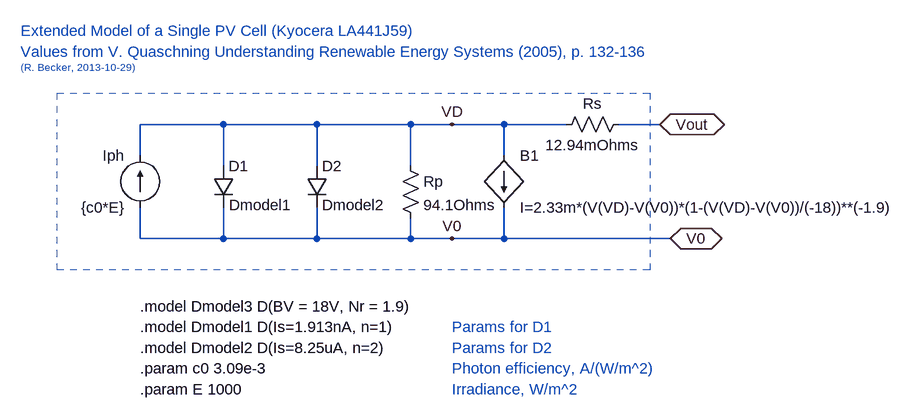
[diagram p0: schematic PVcellExt.asc]
PVcellExt.asc, the LTspice schematic file:
Version 4
SHEET 1 1108 680
WIRE 0 32 -128 32
WIRE 144 32 0 32
WIRE 288 32 144 32
WIRE 352 32 288 32
WIRE 432 32 352 32
WIRE 528 32 432 32
WIRE 672 32 608 32
WIRE -128 80 -128 32
WIRE 432 80 432 32
WIRE 0 96 0 32
WIRE 144 96 144 32
WIRE 288 96 288 32
WIRE -128 208 -128 160
WIRE 0 208 0 160
WIRE 0 208 -128 208
WIRE 144 208 144 160
WIRE 144 208 0 208
WIRE 288 208 288 176
WIRE 288 208 144 208
WIRE 352 208 288 208
WIRE 432 208 432 160
WIRE 432 208 352 208
WIRE 688 208 432 208
FLAG 672 32 Vout
IOPIN 672 32 BiDir
FLAG 688 208 V0
IOPIN 688 208 BiDir
FLAG 352 32 VD
FLAG 352 208 V0
SYMBOL diode -16 96 R0
WINDOW 3 25 60 Left 2
SYMATTR Value Dmodel1
SYMATTR InstName D1
SYMBOL current -128 160 R180
WINDOW 0 24 80 Left 2
WINDOW 3 24 0 Left 2
SYMATTR InstName Iph
SYMATTR Value {c0*E}
SYMBOL diode 128 96 R0
WINDOW 3 24 60 Left 2
SYMATTR Value Dmodel2
SYMATTR InstName D2
SYMBOL res 272 80 R0
SYMATTR InstName Rp
SYMATTR Value 94.1Ohms
SYMBOL res 624 16 R90
WINDOW 0 0 56 VBottom 2
WINDOW 3 32 56 VTop 2
SYMATTR InstName Rs
SYMATTR Value 12.94mOhms
SYMBOL bi 432 80 R0
SYMATTR InstName B1
SYMATTR Value I=2.33m*(V(VD)-V(V0))*(1-(V(VD)-V(V0))/(-18))**(-1.9)
TEXT -128 344 Left 2 !.model Dmodel1 D(Is=1.913nA, n=1)
TEXT -128 376 Left 2 !.model Dmodel2 D(Is=8.25uA, n=2)
TEXT -128 408 Left 2 !.param c0 3.09e-3
TEXT -312 -80 Left 2 ;Values from V. Quaschning Understanding Renewable Energy Systems (2005), p. 132-136
TEXT -312 -112 Left 2 ;Extended Model of a Single PV Cell (Kyocera LA441J59)
TEXT -312 -56 Left 1 ;(R. Becker, 2013-10-29)
TEXT -128 440 Left 2 !.param E 1000
TEXT 352 440 Left 2 ;Irradiance, W/m^2
TEXT 352 408 Left 2 ;Photon efficiency, A/(W/m^2)
TEXT 352 344 Left 2 ;Params for D1
TEXT 352 376 Left 2 ;Params for D2
TEXT -128 312 Left 2 !.model Dmodel3 D(BV = 18V, Nr = 1.9)
RECTANGLE Normal 656 256 -256 -16 1

The netlist it stands for:
* PVcellExt.asc
D1 VD V0 Dmodel1
Iph V0 VD {c0*E}
D2 VD V0 Dmodel2
Rp VD V0 94.1Ohms
Rs Vout VD 12.94mOhms
B1 VD V0 I=2.33m*(V(VD)-V(V0))*(1-(V(VD)-V(V0))/(-18))**(-1.9)
.model D D
.lib standard.dio
.model Dmodel1 D(Is=1.913nA, n=1)
.model Dmodel2 D(Is=8.25uA, n=2)
.param c0 3.09e-3
* Values from V. Quaschning Understanding Renewable Energy Systems (2005), p. 132-136
* Extended Model of a Single PV Cell (Kyocera LA441J59)
* (R. Becker, 2013-10-29)
.param E 1000
* Irradiance, W/m^2
* Photon efficiency, A/(W/m^2)
* Params for D1
* Params for D2
.model Dmodel3 D(BV = 18V, Nr = 1.9)
.backanno
.end